# Altium schematic sheet Модуль питания.SchDoc
size 209 x 297 mm; DocumentNumber: 7; SheetNumber: 7; SheetTotal: 11; ListNumber: 1
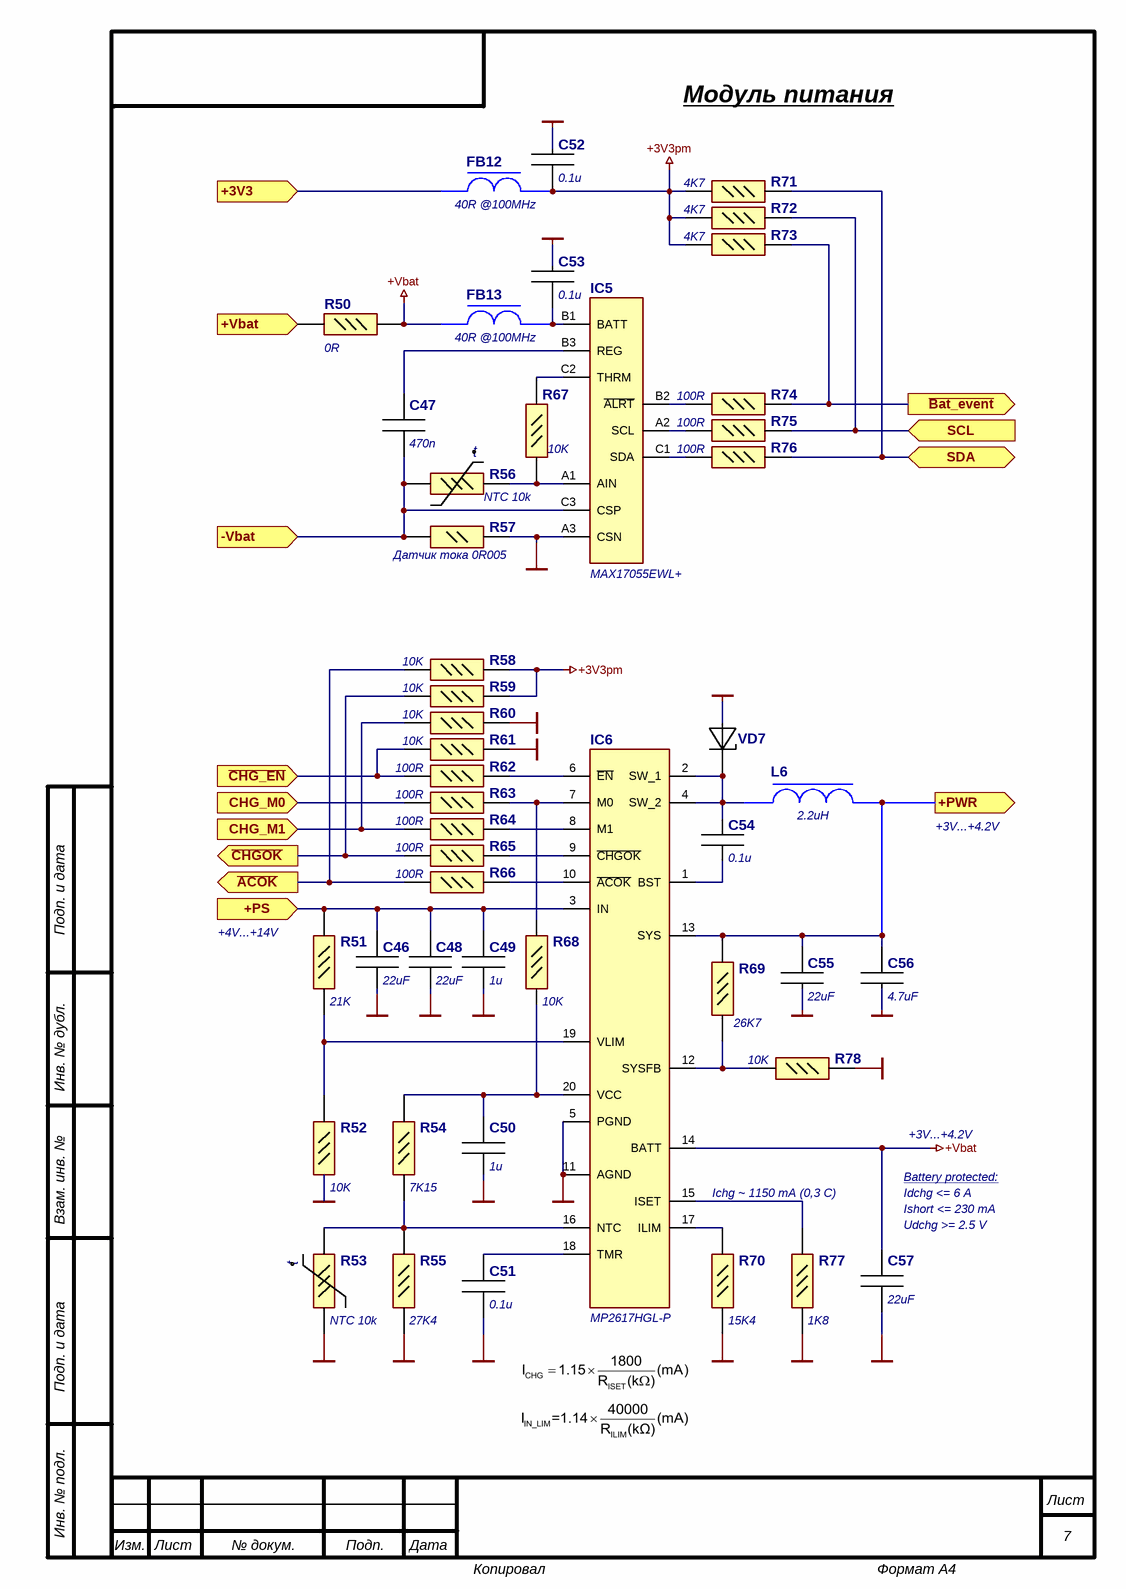
[diagram p0: Модуль питания.SchDoc]

## Parts
C46  22uF  [:CAP0805 C2012X125]
C47  470n  [:CAP0603 C1608х08]
C48  22uF  [:CAP0805 C2012X125]
C49  1u  [:CAP0603 C1608х08]
C50  1u  [:CAP0603 C1608х08]
C51  0.1u  [:CAP0402 100x50x50]
C52  0.1u  [:CAP0402 100x50x50]
C53  0.1u  [:CAP0402 100x50x50]
C54  0.1u  [:CAP0402 100x50x50]
C55  22uF  [:CAP0805 C2012X125]
C56  4.7uF  [:CAP0805 C2012X125]
C57  22uF  [:CAP0805 C2012X125]
FB12  40R @100MHz  [:FER MMZ1005Y400CTD25]
FB13  40R @100MHz  [:FER MMZ1005Y400CTD25]
IC5  MAX17055EWL+  [:BGA9 P150X140X64]
IC6  MP2617HGL-P  [:QFN20 P400X300X100-20N]
L6  2.2uH  [:IND4020]
R50  Manufacturer_Part_Number (part 2: value): 0R  [:RES0402]  (hidden comment: RC0402FR-07)
R51  Manufacturer_Part_Number (part 2: value): 21K  [:RES0402]  (hidden comment: RC0402FR-07)
R52  Manufacturer_Part_Number (part 2: value): 10K  [:RES0402]  (hidden comment: RC0402FR-07)
R53  NTC 10k  [:RES0402]
R54  Manufacturer_Part_Number (part 2: value): 7K15  [:RES0402]  (hidden comment: RC0402FR-07)
R55  Manufacturer_Part_Number (part 2: value): 27K4  [:RES0402]  (hidden comment: RC0402FR-07)
R56  NTC 10k  [:RES0402]
R57  Датчик тока 0R005  [:RES0402]
R58  Manufacturer_Part_Number (part 2: value): 10K  [:RES0402]  (hidden comment: RC0402FR-07)
R59  Manufacturer_Part_Number (part 2: value): 10K  [:RES0402]  (hidden comment: RC0402FR-07)
R60  Manufacturer_Part_Number (part 2: value): 10K  [:RES0402]  (hidden comment: RC0402FR-07)
R61  Manufacturer_Part_Number (part 2: value): 10K  [:RES0402]  (hidden comment: RC0402FR-07)
R62  Manufacturer_Part_Number (part 2: value): 100R  [:RES0402]  (hidden comment: RC0402FR-07)
R63  Manufacturer_Part_Number (part 2: value): 100R  [:RES0402]  (hidden comment: RC0402FR-07)
R64  Manufacturer_Part_Number (part 2: value): 100R  [:RES0402]  (hidden comment: RC0402FR-07)
R65  Manufacturer_Part_Number (part 2: value): 100R  [:RES0402]  (hidden comment: RC0402FR-07)
R66  Manufacturer_Part_Number (part 2: value): 100R  [:RES0402]  (hidden comment: RC0402FR-07)
R67  Manufacturer_Part_Number (part 2: value): 10K  [:RES0402]  (hidden comment: RC0402FR-07)
R68  Manufacturer_Part_Number (part 2: value): 10K  [:RES0402]  (hidden comment: RC0402FR-07)
R69  Manufacturer_Part_Number (part 2: value): 26K7  [:RES0402]  (hidden comment: RC0402FR-07)
R70  Manufacturer_Part_Number (part 2: value): 15K4  [:RES0402]  (hidden comment: RC0402FR-07)
R71  Manufacturer_Part_Number (part 2: value): 4K7  [:RES0402]  (hidden comment: RC0402FR-07)
R72  Manufacturer_Part_Number (part 2: value): 4K7  [:RES0402]  (hidden comment: RC0402FR-07)
R73  Manufacturer_Part_Number (part 2: value): 4K7  [:RES0402]  (hidden comment: RC0402FR-07)
R74  Manufacturer_Part_Number (part 2: value): 100R  [:RES0402]  (hidden comment: RC0402FR-07)
R75  Manufacturer_Part_Number (part 2: value): 100R  [:RES0402]  (hidden comment: RC0402FR-07)
R76  Manufacturer_Part_Number (part 2: value): 100R  [:RES0402]  (hidden comment: RC0402FR-07)
R77  Manufacturer_Part_Number (part 2: value): 1K8  [:RES0402]  (hidden comment: RC0402FR-07)
R78  Manufacturer_Part_Number (part 2: value): 10K  [:RES0402]  (hidden comment: RC0402FR-07)
VD7  40V 1.5A  [:DIODE CST2C]  (value not drawn)

## Ports
+3V3 (in), +PS (in), +PWR (out), +Vbat (in), -Vbat (in), CHG_M0 (in), CHG_M1 (in), SCL (in), SDA (bidir), ~{ACOK} (out), ~{Bat_event} (out), ~{CHG_EN} (in), ~{CHGOK} (out)

## Nets
+3V3pm: C52.2 FB12.1 R58.2 R59.2 R71.1 R72.1 R73.1
+Vbat: C57.2 FB13.2 IC6.14(BATT) R50.2
GND: C46.1 C48.1 C49.1 C50.1 C51.1 C52.1 C53.2 C55.1 C56.1 C57.1 IC5.A3(CSN) IC6.5(PGND) IC6.11(AGND) R52.1 R53.1 R55.1 R57.2 R60.2 R61.2 R70.1 R77.1 R78.2 VD7.2(A)
+3V3: FB12.2 ; port +3V3
+PS: C46.2 C48.2 C49.2 IC6.3(IN) R51.2 ; port +PS
+PWR: C55.2 C56.2 IC6.13(SYS) L6.2 R69.2 ; port +PWR
+Vbat: R50.1 ; port +Vbat  [a separate net that carries the same name]
-Vbat: C47.1 IC5.C3(CSP) R56.1 R57.1 ; port -Vbat
~{ACOK}: R58.1 R66.1 ; port ~{ACOK}
~{Bat_event}: R73.2 R74.2 ; port ~{Bat_event}
~{CHG_EN}: R61.1 R62.1 ; port ~{CHG_EN}
~{CHGOK}: R59.1 R65.1 ; port ~{CHGOK}
CHG_M0: R63.1 ; port CHG_M0
CHG_M1: R60.1 R64.1 ; port CHG_M1
SCL: R72.2 R75.2 ; port SCL
SDA: R71.2 R76.2 ; port SDA
NetC47_2: C47.2 IC5.B3(REG)
NetC50_2: C50.2 IC6.20(VCC) R54.2 R68.1
NetC51_2: C51.2 IC6.18(TMR)
NetC53_1: C53.1 FB13.1 IC5.B1(BATT)
NetC54_1: C54.1 IC6.2(SW_1) IC6.4(SW_2) L6.1 VD7.1(K)
NetC54_2: C54.2 IC6.1(BST)
NetIC5_A1: IC5.A1(AIN) R56.2 R67.1
NetIC5_A2: IC5.A2(SCL) R75.1
NetIC5_B2: IC5.B2(~{ALRT}) R74.1
NetIC5_C1: IC5.C1(SDA) R76.1
NetIC5_C2: IC5.C2(THRM) R67.2
NetIC6_6: IC6.6(~{EN}) R62.2
NetIC6_7: IC6.7(M0) R63.2 R68.2
NetIC6_8: IC6.8(M1) R64.2
NetIC6_9: IC6.9(~{CHGOK}) R65.2
NetIC6_10: IC6.10(~{ACOK}) R66.2
NetIC6_12: IC6.12(SYSFB) R69.1 R78.1
NetIC6_15: IC6.15(ISET) R77.2
NetIC6_16: IC6.16(NTC) R53.2 R54.1 R55.2
NetIC6_17: IC6.17(ILIM) R70.2
NetIC6_19: IC6.19(VLIM) R51.1 R52.2

## Notes on the sheet
- (near C52) Модуль питания
- +3V...+4.2V
- (near R51) +4V...+14V
- Ichg ~ 1150 mA (0,3 С)
- Idchg <= 6 A
- Battery protected:
- (near C57) Udchg >= 2.5 V
- Ishort <= 230 mA
- Подп. и дата
- Инв. № дубл.
- Взам. инв. №
- Инв. № подл.
- Лист
- Изм.
- № докум.
- Подп.
- Дата
- Копировал
- Формат А4
- (in symbol NCP15XH103D03RC) t

## Library data of the parts
C46 C48 C55 C57 = GRM21BR61C226ME44L: CAP CER 22uF 16V X5R; Manufacturer_Name: Murata Electronics; Short Description: 0805 22uF 16V; Datasheet Link: https://psearch.en.murata.com/capacitor/product/GRM21BR61C226ME44%23.html; Height: 1.45mm; Manufacturer_Part_Number: GRM21BR61C226ME44L; Mouser Part Number: 81-GRM21BR61C226ME4L; Mouser Price/Stock: https://www.mouser.co.uk/ProductDetail/Murata-Electronics/GRM21BR61C226ME44L?qs=H45D%252BQBid9ZSEksDj3jAIw%3D%3D; Arrow Part Number: GRM21BR61C226ME44L; Arrow Price/Stock: https://www.arrow.com/en/products/grm21br61c226me44l/murata-manufacturing
C47 = GCM188R71E474KA64D: ±10% 25V Ceramic Capacitor X7R 0603 (1608 Metric); Manufacturer_Name: Murata Electronics; Short Description: 0603 470n 25V; Height: 0.9mm; Manufacturer_Part_Number: GCM188R71E474KA64D
C49 C50 = GCM188R71E105KA64D: ±10% 25V Ceramic Capacitor X7R 0603 (1608 Metric); Manufacturer_Name: Murata Electronics; Short Description: 0603 1u 25V; Height: 0.9mm; Manufacturer_Part_Number: GCM188R71E105KA64D
C51-C54 = GRM155R71E104KE14J: ±10% 25V Ceramic Capacitor X7R 0402 (1005 Metric); Manufacturer_Name: Murata Electronics; Short Description: 0402 0.1uF 25V; Datasheet Link: http://www.murata.com/~/media/webrenewal/support/library/catalog/products/capacitor/mlcc/c02e.pdf; Height: 0.55mm; Manufacturer_Part_Number: GRM155R71E104KE14J; Mouser Part Number: 81-GRM155R71E104KE4J; Mouser Price/Stock: https://www.mouser.co.uk/ProductDetail/Murata-Electronics/GRM155R71E104KE14J?qs=hNud%2FORuBR2EQtvG2InwAQ%3D%3D; Arrow Part Number: GRM155R71E104KE14J; Arrow Price/Stock: https://www.arrow.com/en/products/grm155r71e104ke14j/murata-manufacturing
C56 = GRM21BZ71E475KE15L: CAP CER 4.7uF 25V X7R 0805; Manufacturer_Name: Murata Electronics; Short Description: 0805 4.7uF 25V; Datasheet Link: https://search.murata.co.jp/Ceramy/image/img/A01X/G101/ENG/GRM21BZ71E475KE15-01.pdf; Height: 1.45mm; Manufacturer_Part_Number: GRM21BZ71E475KE15L
FB12 FB13 = MMZ1005Y400CTD25: 40 Ohms @ 100MHz 1 Signal Line Ferrite Bead 0402 (1005 Metric) 550mA 100mOhm; Manufacturer_Name: TDK; Short Description: 0402 40R @100MHz; Datasheet Link: https://www.arrow.com/en/products/mmz1005y400ctd25/tdk; Height: 0.55mm; Manufacturer_Part_Number: MMZ1005Y400CTD25; Mouser Part Number: 810-MMZ1005Y400CTD25; Mouser Price/Stock: https://www.mouser.com/Search/Refine.aspx?Keyword=810-MMZ1005Y400CTD25; Arrow Part Number: MMZ1005Y400CTD25; Arrow Price/Stock: https://www.arrow.com/en/products/mmz1005y400ctd25/tdk
IC5 = MAX17055EWL+: Battery Monitor ModelGauge m5 EZ; Manufacturer_Name: Maxim Integrated; Datasheet Link: https://componentsearchengine.com/Datasheets/1/MAX17055EWL+.pdf; Height: 0.69mm; Manufacturer_Part_Number: MAX17055EWL+; Mouser Part Number: 700-MAX17055EWL+; Mouser Price/Stock: https://www.mouser.com/Search/Refine.aspx?Keyword=700-MAX17055EWL%2B
IC6 = MP2617HGL-P: 3А charge controller With NVDC Power Path; Manufacturer_Name: Monolithic Power Systems (MPS); Datasheet Link: https://www.monolithicpower.com/pub/media/document/m/p/mp2617h_r1.03.pdf; Height: 1mm; Manufacturer_Part_Number: MP2617HGL-P; Mouser Part Number: 946-MP2617HGL-P; Mouser Price/Stock: https://www.mouser.co.uk/ProductDetail/Monolithic-Power-Systems-MPS/MP2617HGL-P?qs=IW9Tsl75qsV295J2ZL59tA%3D%3D
L6 = 74438356022: 2.2uH Shielded Molded Inductor 4.7A 35mOhm Max 2-SMD / Current - Saturation (Isat) 6.2A / Current Rating (Amps) 4.7A / Self Resonant 34MHz; Manufacturer_Name: Würth Elektronik; Short Description: 2.2uH 4.7A 35mOhm; Manufacturer_Part_Number: 74438356022
R50-R52 R54 R55 R58-R78 = RC0402FR-07: Resistor 0402 1% 1/16W / Value Range: 1Ω ... 10 MΩ / Value Example: / 0R = 0Ω / 97R6 = 97.6Ω / 9K76 = 9760Ω / 1M = 1,000,000Ω; Manufacturer_Name: YAGEO; Manufacturer_Part_Number (part 3: after value): L; Short Description: 0402 1%; Datasheet Link: http://www.yageo.com/documents/recent/PYu-RC0402_51_RoHS_L_6_r.pdf; Height: 0.4mm; Manufacturer_Part_Number: RC0402FR-07; Parameter 1: *
R53 R56 = NCP15XH103D03RC: THERMISTOR NTC 10KOHM 3380K 0402; Manufacturer_Name: Murata Electronics; Short Description: 0402 NTC 10k; Datasheet Link: https://www.murata.com/en-eu/api/pdfdownloadapi?cate=luNTCforTempeSenso&partno=NCP15XH103D03RC; Height: 0.55mm; Manufacturer_Part_Number: NCP15XH103D03RC; Mouser Part Number: 81-NCP15XH103D03RC; Mouser Price/Stock: https://www.mouser.co.uk/ProductDetail/Murata-Electronics/NCP15XH103D03RC?qs=xRHrB6DKEaKERViC4X8eqg%3D%3D; Arrow Part Number: NCP15XH103D03RC; Arrow Price/Stock: https://www.arrow.com/en/products/ncp15xh103d03rc/murata-manufacturing
R57 = LVT04R0050FER: Resistor 0402 1% 0.33W; Manufacturer_Name: Ohmite; Short Description: 0402 1% 0R005; Manufacturer_Part_Number: LVT04R0050FER; Mouser Part Number: 594-MCS04020C6801FE0
VD7 = CCS15S40,L3F: Diode Schottky 40V 1.5A / @If 550mV @ 1.5A / @Vr 200µA @ 40V; Manufacturer_Name: Toshiba; Short Description: 0603 40V 1.5A; Manufacturer_Part_Number: CCS15S40,L3F